# EasyEDA Pro project ProPrj_SRC_Robot2025_V1.0_2026-09-06.epro, board PCB-IR
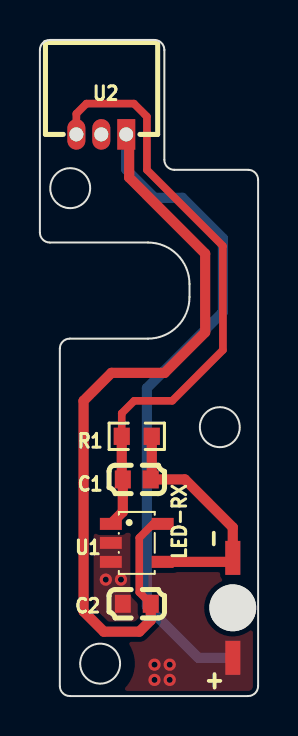
[diagram p13: board, top side]
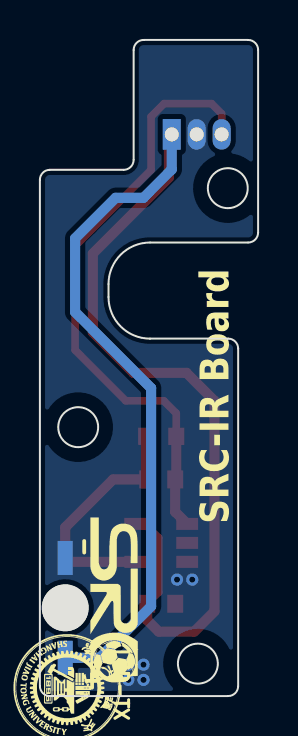
[diagram p14: board, bottom side, seen from below]

Outline 10.94 x 32.84 mm; copper layers: Top Layer, Bottom Layer. Coordinates in mm from the lower left corner of the outline.
Outline path: circle c1.52,25.42 r1 ; circle c3.02,1.62 r1 ; circle c9.02,13.46 r1 ; 0,32.34 0,23.2 arc(0.15,22.85) 0.5,22.7 5.42,22.7 arc(6.89,22.09) 7.5,20.62 7.5,19.97 arc(6.89,18.5) 5.42,17.89 1.5,17.89 arc(1.15,17.74) 1,17.39 1,0.5 arc(1.15,0.15) 1.5,0 10.44,0 arc(10.79,0.15) 10.94,0.5 10.94,25.84 arc(10.79,26.19) 10.44,26.34 6.74,26.34 arc(6.39,26.49) 6.24,26.84 6.24,32.34 arc(6.09,32.69) 5.74,32.84 0.5,32.84 arc(0.15,32.69) 0,32.34
Stack: Top Layer 0.035mm / Dielectric1 1.51mm FR4 er 4.5 / Bottom Layer 0.035mm

## Design rules (mm)
template: 自定义配置
spacing copperThickness1oz (default): track to track 0.102, other pairs 0 to 1
spacing copperThickness2oz: track to track 0.203, other pairs 0.152 to 0.3
track width copperThickness1oz (default): min 0.127, default 0.254, max 2.54
track width copperThickness2oz: min 0.203, default 0.254, max 2.54
differential pair differentialPair (default): width min 0.127, default 0.254, max 2.54; gap min 0.152, default 0.152
via viaSize (default): diameter min 0.5, default 0.61, max 10; hole min 0.3, default 0.305, max 6.3

## Placement (name value [footprint] x y rotation side)
C1  10pF  [C0603]  4.86 10.84 180 top
C2  10uF  [C0603]  4.86 4.62 180 top
LED-RX  TEMD1000  [VSMB2000X01]  9.67 4.42 270 top
LED-TX  -  [VSMB2000X01]  9.67 4.42 270 bottom
R1  1MΩ  [R0603]  4.86 13 180 top
U1  OPA320AIDBVR  [SOT-23-5_L3.0-W1.7-P0.95-LS2.8-BR]  4.86 7.67 180 top
U2  BX-MX1.25-3PWZ  [CONN-TH_3P-P1.25_BX-MX1.25-3PWZ]  3.08 28.11 180 top

## Footprints (pads in the part's own frame, mm; a bottom-side part is the same pattern mirrored in y, then rotated)
C0603
  rect 0.8x0.9 smd: 1(-0.7,0) 2(0.7,0)
CONN-TH_3P-P1.25_BX-MX1.25-3PWZ
  rect 0.9x1.524 hole 0.7: 1(-1.25,0)
  oval 0.9x1.524 hole 0.7: 2(0,0) 3(1.25,0)
R0603
  rect 0.806x0.864 smd: 1(-0.753,0) 2(0.753,0)
SOT-23-5_L3.0-W1.7-P0.95-LS2.8-BR
  rect 1.1x0.6 smd: 1(1.3,-0.95) 2(1.3,0) 3(1.3,0.95) 4(-1.3,0.95) 5(-1.3,-0.95)
VSMB2000X01
  custom 1.7x0.75 smd: 1(-2.5,0) 2(2.5,0)

## Nets
As in the schematic.

## Via types
v1: diameter 0.61, hole 0.305, Top Layer to Bottom Layer, 6 vias

## Routing (per net, layer and track width the routed paths; a pad name or vN(x,y) marks a point on that pad's centre or on a via; arc(x,y) is an arc through that point)
3V3: length 72.8
  Top Layer w0.381: 6.16,8.62 5.68,8.62 4.98,7.92 4.98,5.19 C2.1
  Top Layer w0.508: C2.1 5.56,3.8 4.98,3.22 3.21,3.22 2.19,4.24 2.19,14.78 3.59,16.18 6.25,16.18 8.29,18.21 8.29,22.14 4.48,25.95 4.48,27.97 U2.1
  Bottom Layer w0.508: LED-TX.2 7.94,1.92 5.36,4.49 5.36,15.41 9.17,19.22 9.17,22.91 7.14,24.94 5.75,24.94 4.33,26.36 U2.1
GND:
  vias: v1(3.3,5.83) v1(4.06,5.83) v1(5.75,1.57) v1(5.75,0.81) v1(6.51,1.57) v1(6.51,0.81)
IR-ADC: length 30.5
  Top Layer w0.381: U2.3 1.83,29.15 2.33,29.65 4.71,29.65 5.36,29 5.36,26.34 9.17,22.53 9.17,17.32 6.63,14.78 4.73,14.78 4.1,14.15 R1.2
  Top Layer w0.508: U1.1 4.16,9.22 4.16,10.84 4.1,10.9 R1.2
$1N304: length 12.4
  Top Layer w0.508: R1.1 5.61,10.9 C1.1 7.27,10.84 9.67,8.44 LED-RX.1 9.47,6.72 6.16,6.72

## Copper pours and planes (outline as drawn; the poured copper is in the pictures)
GND on Top Layer: 1,8.17 10.92,8.17 10.92,0 1,0
GND on Bottom Layer: -4.29,34.72 13.75,34.72 13.75,-0.72 -4.29,-0.72

## Text on the board
Bottom Silkscreen Layer: + | - | SRC-IR Board
Top Silkscreen Layer: + | -
